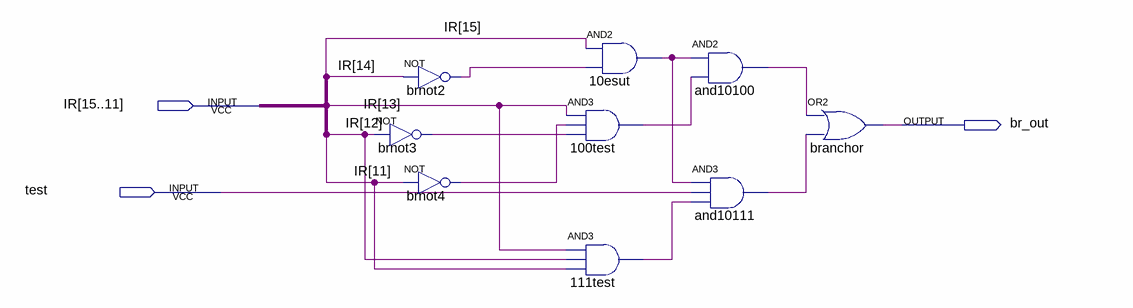
[diagram p0: schematic sheet]
// Quartus schematic comcheck-bunki.bdf as structural Verilog: 9 symbols, 3 pins
module \comcheck-bunki  (
  input  [15:11] IR,
  input  test,
  output br_out
);

  wire and10100_out, and10111_out, brnot2_out, brnot3_out, brnot4_out, n10esut_out, n100test_out,
       n111test_out;

  not brnot2 (brnot2_out, IR[14]);
  not brnot3 (brnot3_out, IR[12]);
  not brnot4 (brnot4_out, IR[11]);
  and u_100test (n100test_out, IR[13], brnot4_out, brnot3_out);
  and u_111test (n111test_out, IR[13], IR[12], IR[11]);
  and u_10esut (n10esut_out, IR[15], brnot2_out);
  and and10100 (and10100_out, n10esut_out, n100test_out);
  and and10111 (and10111_out, n10esut_out, test, n111test_out);
  or branchor (br_out, and10100_out, and10111_out);
endmodule
